# Altium schematic sheet GPS_L80.SchDoc
size A
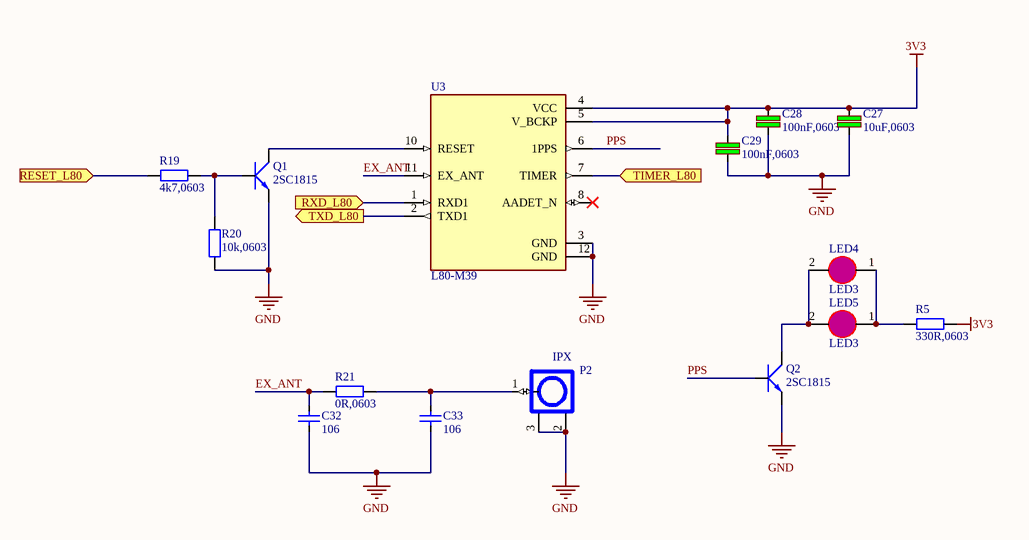
[diagram p0: GPS_L80.SchDoc]

## Parts
C27  value 10uF,0603  [CAP_0603]  (hidden comment: 4.7uF)
C28  value 100nF,0603  [CAP_0603]  (hidden comment: 4.7uF)
C29  value 100nF,0603  [CAP_0603]  (hidden comment: 4.7uF)
C32  106  [CAP_0603]
C33  106  [CAP_0603]
LED4  LED3  [LED0805]
LED5  LED3  [LED0805]
P2  IPX  [IPXS]
Q1  2SC1815  [SOT23]
Q2  2SC1815  [SOT23-321]
R5  330R,0603  [RES-SMD-0603]
R19  4k7,0603  [RES-SMD-0603]
R20  10k,0603  [RES-SMD-0603]
R21  0R,0603  [RES-SMD-0603]
U3  L80-M39  [XCVR_L80-M39]

## Ports
RESET_L80 (in), RXD_L80 (in), TIMER_L80 (in), TXD_L80 (out)

## Nets
3V3: C27.2 C28.2 C29.2 R5.1 U3.4(VCC) U3.5(V_BCKP)
GND: C27.1 C28.1 C29.1 C32.1 C33.1 P2.2 P2.3 Q1.1(E) Q2.1(E) R20.1 U3.3(GND) U3.12(GND)
EX_ANT: C32.2 R21.2 U3.11(EX_ANT)
PPS: Q2.3(B) U3.6(1PPS)
RESET_L80: R19.2 ; port RESET_L80
RXD_L80: U3.1(RXD1) ; port RXD_L80
TIMER_L80: U3.7(TIMER) ; port TIMER_L80
TXD_L80: U3.2(TXD1) ; port TXD_L80
NetC33_2: C33.2 P2.1 R21.1
NetLED4_1: LED4.1(A) LED5.1(A) R5.2
NetLED4_2: LED4.2(K) LED5.2(K) Q2.2(C)
NetQ1_2: Q1.2(C) U3.10(RESET)
NetQ1_3: Q1.3(B) R19.1 R20.2

Not connected (* = marked no-connect by the designer): U3 8(AADET_N)*

## Library data of the parts
C27-C29 = C: 4.7µF ±10% 35V Ceramic Capacitor X5R 0805 (2012 Metric); Manufacturer: Samsung Electro-Mechanics; Part number: CL21A475KLCLQNC; User_Description: CAP CER 4.7UF 35V X5R 0805; Category: CAPACITOR; Package: 0805
C32 C33 = CapSMD: Capacitor; Value: 33p; Published: 8-Jun-2000; LatestRevisionDate: 17-Jul-2002; LatestRevisionNote: Re-released for DXP Platform.; PackageReference: RAD-0.3; Publisher: Altium Limited
LED4 LED5 = LED0805: LED SMD 0805
P2 = IPXSx66: Antenna GSM GPS; Manufacturer: TE Connectivity AMP Connectors; Part number: 2334884-1; User_Description: UMCC MICRO-COAX RECEPTACLE, GEN; Category: Connectors; Package: SMD
Q1 Q2 = 2SC1815: NPN 600mW, ECB; Value: C1815
R5 R19-R21 = Resistor - SMD: Resistor SMD; Manufacturer: Generic Components; Class: Passive; Published: 08/06/2000; Publisher: Altium Hobart Technology Centre
U3 = L80-M39: L80 is an ultra compact GPS POT (Patch on Top) module with an embedded 15.0mm Ã— 15.0mm Ã— 4.0mm patch antenna.; MF: Quectel; Check_prices: https://www.snapeda.com/parts/L80-M39/Quectel/view-part/51186/?ref=eda; Price: None; Package: None; Purchase-URL: https://pricing.snapeda.com/search/part/L80-M39/?ref=eda; Value: *; MP: L80-M39; SnapEDA_Link: https://www.snapeda.com/parts/L80-M39/Quectel/view-part/51186/?ref=snap; Availability: Warning